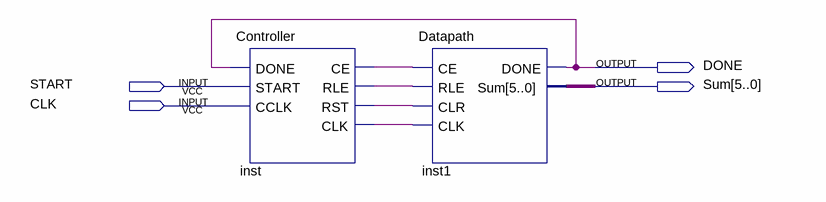
[diagram p0: schematic sheet]
// Quartus schematic Sum8.bdf as structural Verilog: 2 symbols, 4 pins
module Sum8 (
  input  START,
  input  CLK,
  output DONE,
  output [5:0] Sum
);

  wire inst_ce, inst_clk, inst_rle, inst_rst;

  Controller inst (
    .DONE(DONE), .START(START), .CCLK(CLK), .CE(inst_ce), .RLE(inst_rle), .RST(inst_rst), .CLK(inst_clk));
  Datapath inst1 (.CE(inst_ce), .RLE(inst_rle), .CLR(inst_rst), .CLK(inst_clk), .DONE(DONE), .Sum(Sum));
endmodule
